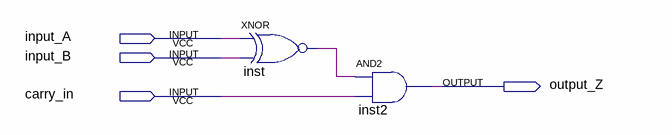
[diagram p0: schematic sheet]
// Quartus schematic equals_bit.bdf as structural Verilog: 2 symbols, 4 pins
module equals_bit (
  input  input_A,
  input  input_B,
  input  carry_in,
  output output_Z
);

  wire inst_out;

  xnor inst (inst_out, input_A, input_B);
  and inst2 (output_Z, inst_out, carry_in);
endmodule
